# Vivado block design Uart_ETH, xc7z020clg400-1, Vivado 2017.2
# (continued, part 3 of 6)
current_bd_instance /Uart_Blocks/Uart_1
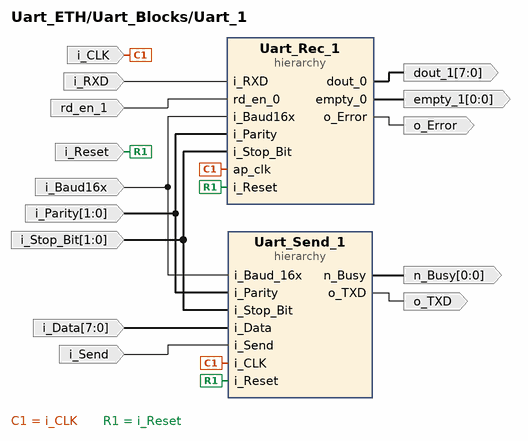
[diagram p48: block diagram inside /Uart_Blocks/Uart_1]
create_bd_pin -dir I -type clk i_CLK
create_bd_pin -dir I i_RXD
create_bd_pin -dir I -type rst i_Reset
create_bd_pin -dir I rd_en_1
create_bd_pin -dir O -from 7 -to 0 dout_1
create_bd_pin -dir O -from 0 -to 0 empty_1
create_bd_pin -dir I -from 7 -to 0 i_Data
create_bd_pin -dir O -from 0 -to 0 n_Busy
create_bd_pin -dir I i_Send
create_bd_pin -dir O o_TXD
create_bd_pin -dir I i_Baud16x
create_bd_pin -dir I -from 1 -to 0 i_Parity
create_bd_pin -dir I -from 1 -to 0 i_Stop_Bit
create_bd_pin -dir O o_Error

create_bd_cell -type hier Uart_Rec_1
create_bd_cell -type hier Uart_Send_1

# ---- hierarchy /Uart_Blocks/Uart_1/Uart_Rec_1 ----
current_bd_instance /Uart_Blocks/Uart_1/Uart_Rec_1
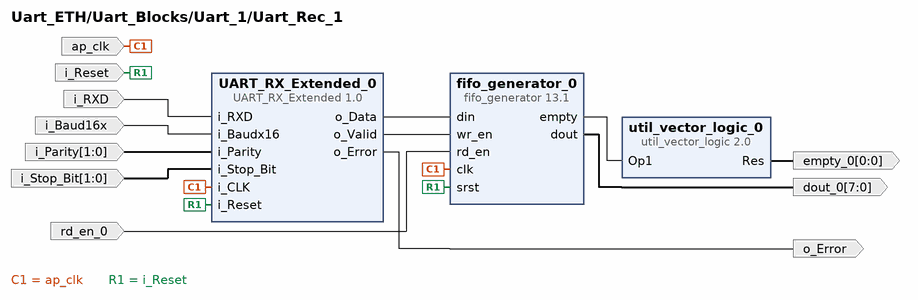
[diagram p49: block diagram inside /Uart_Blocks/Uart_1/Uart_Rec_1]
create_bd_pin -dir I -type clk ap_clk
create_bd_pin -dir I i_RXD
create_bd_pin -dir I -type rst i_Reset
create_bd_pin -dir O -from 7 -to 0 dout_0
create_bd_pin -dir I rd_en_0
create_bd_pin -dir O -from 0 -to 0 empty_0
create_bd_pin -dir I i_Baud16x
create_bd_pin -dir I -from 1 -to 0 i_Parity
create_bd_pin -dir I -from 1 -to 0 i_Stop_Bit
create_bd_pin -dir O o_Error

create_bd_cell -type ip -vlnv xilinx.com:ip:util_vector_logic:2.0 util_vector_logic_0
set_property -dict {CONFIG.C_SIZE 1 CONFIG.C_OPERATION not} [get_bd_cells util_vector_logic_0]
create_bd_cell -type ip -vlnv xilinx.com:ip:fifo_generator:13.1 fifo_generator_0
set_property -dict [list \
  CONFIG.Performance_Options First_Word_Fall_Through \
  CONFIG.Input_Data_Width 8 \
  CONFIG.Input_Depth 256 \
  CONFIG.Output_Data_Width 8 \
  CONFIG.Data_Count true \
  CONFIG.Data_Count_Width 9 \
] [get_bd_cells fifo_generator_0]
create_bd_cell -type ip -vlnv xilinx.com:user:UART_RX_Extended:1.0 UART_RX_Extended_0

# ---- hierarchy /Uart_Blocks/Uart_1/Uart_Send_1 ----
current_bd_instance /Uart_Blocks/Uart_1/Uart_Send_1
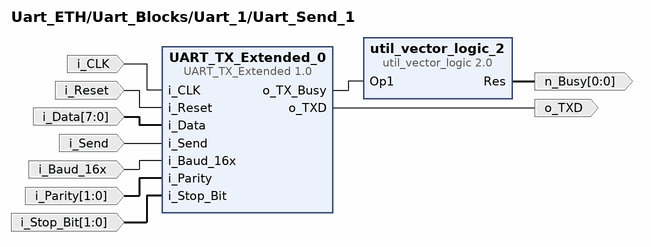
[diagram p50: block diagram inside /Uart_Blocks/Uart_1/Uart_Send_1]
create_bd_pin -dir O -from 0 -to 0 n_Busy
create_bd_pin -dir I -type clk i_CLK
create_bd_pin -dir I -type rst i_Reset
create_bd_pin -dir I -from 7 -to 0 i_Data
create_bd_pin -dir I i_Send
create_bd_pin -dir O o_TXD
create_bd_pin -dir I i_Baud_16x
create_bd_pin -dir I -from 1 -to 0 i_Parity
create_bd_pin -dir I -from 1 -to 0 i_Stop_Bit

create_bd_cell -type ip -vlnv xilinx.com:ip:util_vector_logic:2.0 util_vector_logic_2
set_property -dict {CONFIG.C_SIZE 1 CONFIG.C_OPERATION not} [get_bd_cells util_vector_logic_2]
create_bd_cell -type ip -vlnv xilinx.com:user:UART_TX_Extended:1.0 UART_TX_Extended_0

# ---- hierarchy /Uart_Blocks/Buadrate_Generator ----
current_bd_instance /Uart_Blocks/Buadrate_Generator
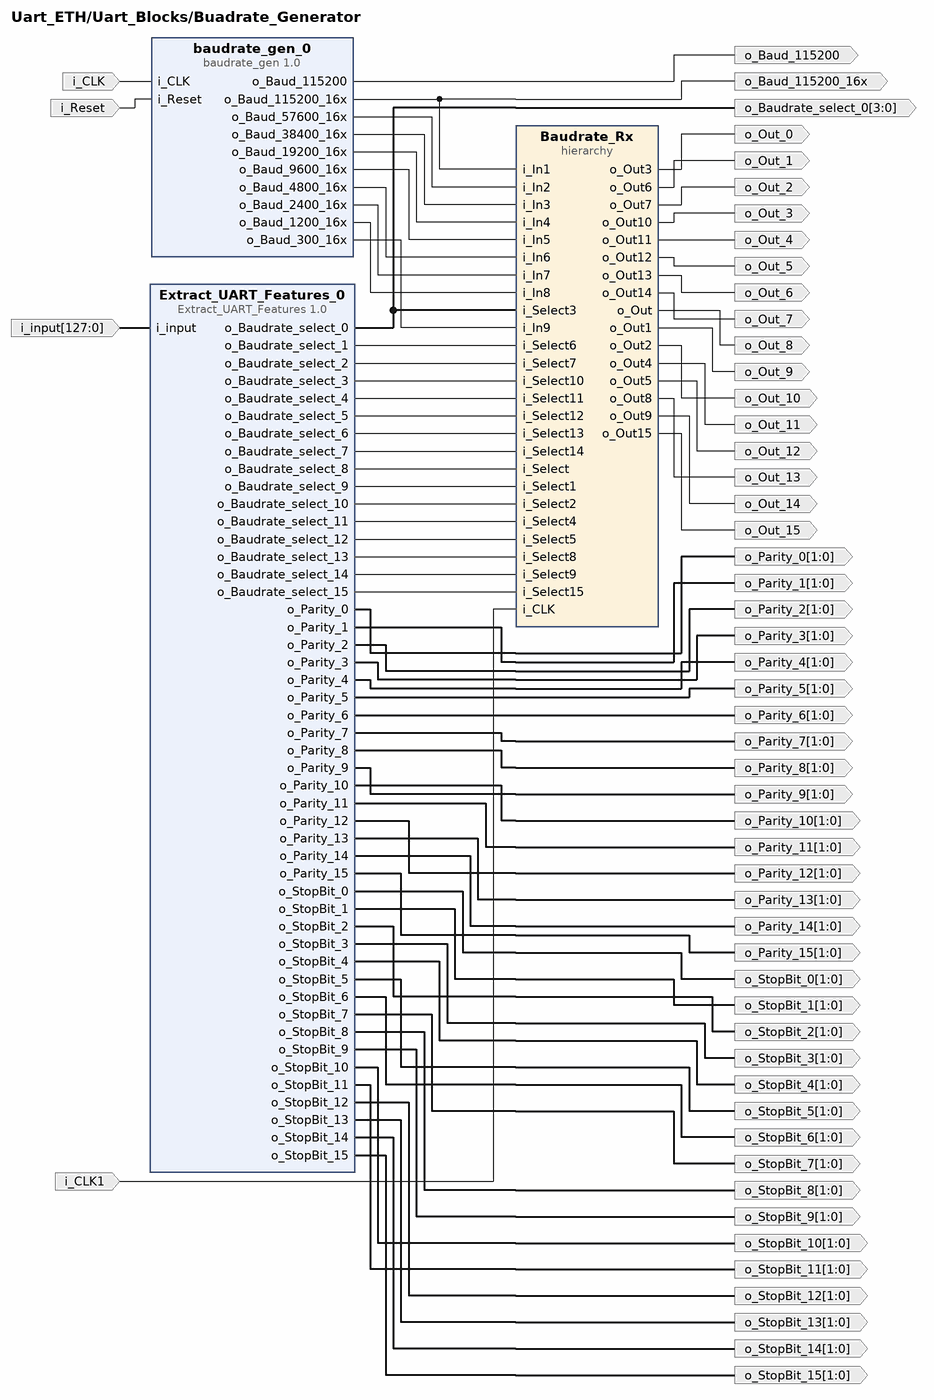
[diagram p51: block diagram inside /Uart_Blocks/Buadrate_Generator]
create_bd_pin -dir I -type clk i_CLK
create_bd_pin -dir I -type rst i_Reset
create_bd_pin -dir I -type clk i_CLK1
create_bd_pin -dir O o_Out_0
create_bd_pin -dir O -from 3 -to 0 o_Baudrate_select_0
create_bd_pin -dir O o_Out_1
create_bd_pin -dir O o_Out_2
create_bd_pin -dir O o_Out_3
create_bd_pin -dir O o_Out_4
create_bd_pin -dir O o_Out_5
create_bd_pin -dir O o_Out_6
create_bd_pin -dir O o_Out_7
create_bd_pin -dir O o_Out_8
create_bd_pin -dir O o_Out_9
create_bd_pin -dir O o_Out_10
create_bd_pin -dir O o_Out_11
create_bd_pin -dir O o_Out_12
create_bd_pin -dir O o_Out_13
create_bd_pin -dir O o_Out_14
create_bd_pin -dir O o_Out_15
create_bd_pin -dir O o_Baud_115200
create_bd_pin -dir O o_Baud_115200_16x
create_bd_pin -dir I -from 127 -to 0 i_input
create_bd_pin -dir O -from 1 -to 0 o_Parity_0
create_bd_pin -dir O -from 1 -to 0 o_Parity_1
create_bd_pin -dir O -from 1 -to 0 o_Parity_2
create_bd_pin -dir O -from 1 -to 0 o_Parity_3
create_bd_pin -dir O -from 1 -to 0 o_Parity_4
create_bd_pin -dir O -from 1 -to 0 o_Parity_5
create_bd_pin -dir O -from 1 -to 0 o_Parity_6
create_bd_pin -dir O -from 1 -to 0 o_Parity_7
create_bd_pin -dir O -from 1 -to 0 o_Parity_8
create_bd_pin -dir O -from 1 -to 0 o_Parity_9
create_bd_pin -dir O -from 1 -to 0 o_Parity_10
create_bd_pin -dir O -from 1 -to 0 o_Parity_11
create_bd_pin -dir O -from 1 -to 0 o_Parity_12
create_bd_pin -dir O -from 1 -to 0 o_Parity_13
create_bd_pin -dir O -from 1 -to 0 o_Parity_14
create_bd_pin -dir O -from 1 -to 0 o_Parity_15
create_bd_pin -dir O -from 1 -to 0 o_StopBit_0
create_bd_pin -dir O -from 1 -to 0 o_StopBit_1
create_bd_pin -dir O -from 1 -to 0 o_StopBit_2
create_bd_pin -dir O -from 1 -to 0 o_StopBit_3
create_bd_pin -dir O -from 1 -to 0 o_StopBit_4
create_bd_pin -dir O -from 1 -to 0 o_StopBit_5
create_bd_pin -dir O -from 1 -to 0 o_StopBit_6
create_bd_pin -dir O -from 1 -to 0 o_StopBit_7
create_bd_pin -dir O -from 1 -to 0 o_StopBit_8
create_bd_pin -dir O -from 1 -to 0 o_StopBit_9
create_bd_pin -dir O -from 1 -to 0 o_StopBit_10
create_bd_pin -dir O -from 1 -to 0 o_StopBit_11
create_bd_pin -dir O -from 1 -to 0 o_StopBit_12
create_bd_pin -dir O -from 1 -to 0 o_StopBit_13
create_bd_pin -dir O -from 1 -to 0 o_StopBit_14
create_bd_pin -dir O -from 1 -to 0 o_StopBit_15

create_bd_cell -type ip -vlnv xilinx.com:user:baudrate_gen:1.0 baudrate_gen_0
create_bd_cell -type hier Baudrate_Rx
create_bd_cell -type ip -vlnv xilinx.com:user:Extract_UART_Features:1.0 Extract_UART_Features_0

# ---- hierarchy /Uart_Blocks/Buadrate_Generator/Baudrate_Rx ----
current_bd_instance /Uart_Blocks/Buadrate_Generator/Baudrate_Rx
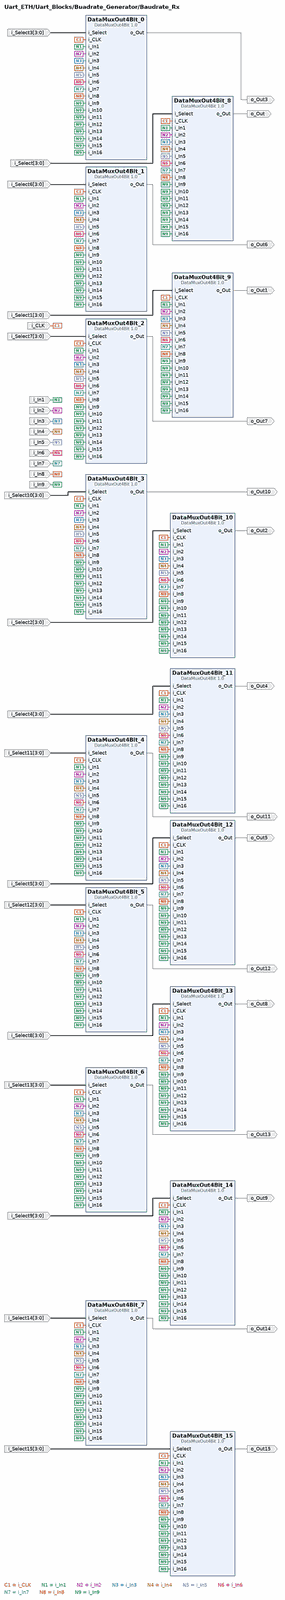
[diagram p52: block diagram inside /Uart_Blocks/Buadrate_Generator/Baudrate_Rx, whole]
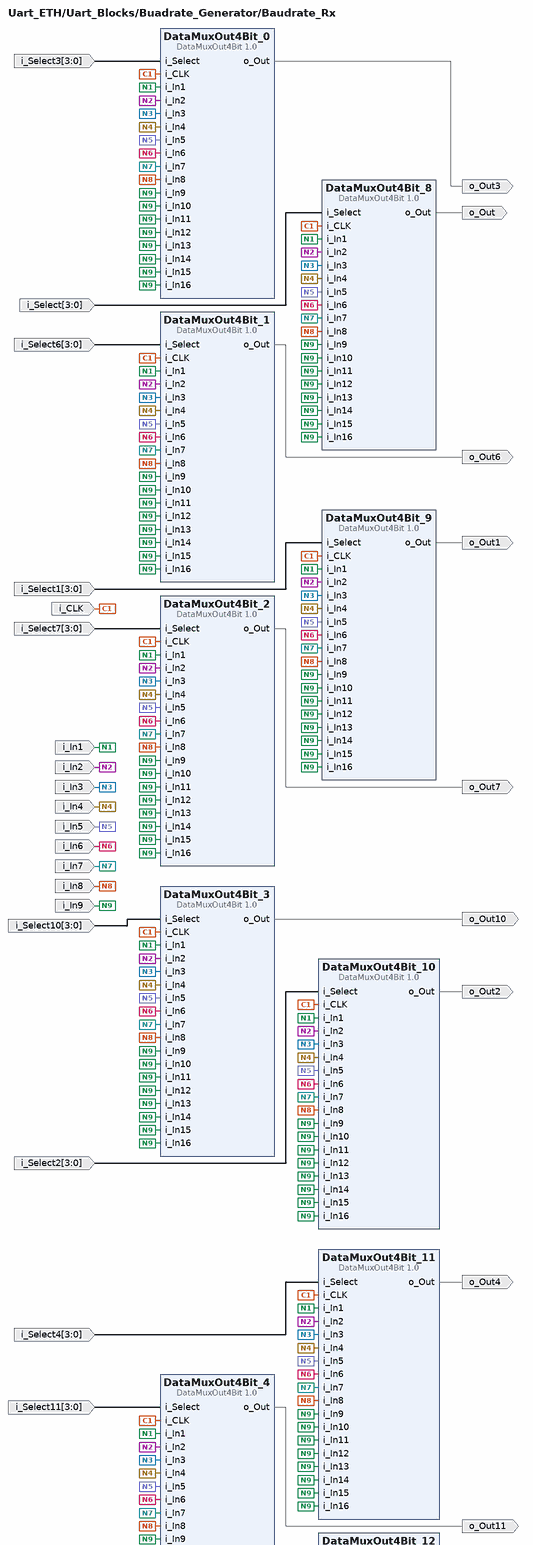
[diagram p53: block diagram inside /Uart_Blocks/Buadrate_Generator/Baudrate_Rx, upper part]
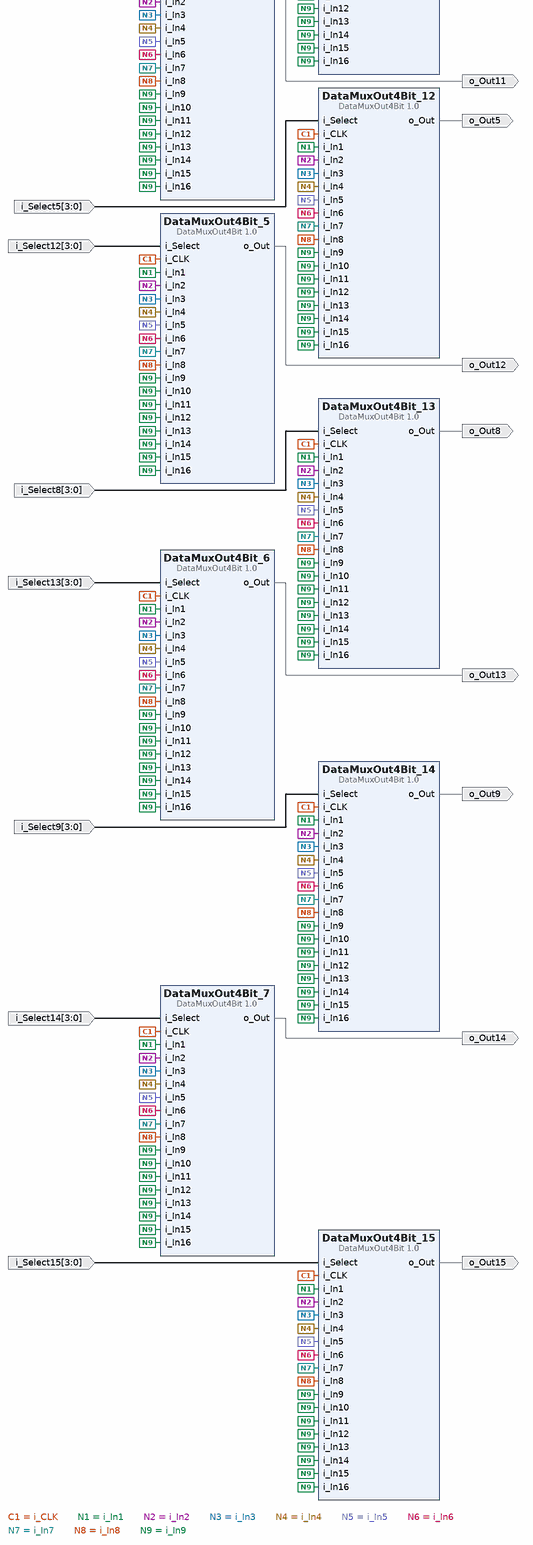
[diagram p54: block diagram inside /Uart_Blocks/Buadrate_Generator/Baudrate_Rx, lower part]
create_bd_pin -dir I -type clk i_CLK
create_bd_pin -dir I i_In1
create_bd_pin -dir I i_In2
create_bd_pin -dir I i_In3
create_bd_pin -dir I i_In4
create_bd_pin -dir I i_In5
create_bd_pin -dir I i_In6
create_bd_pin -dir I i_In7
create_bd_pin -dir I i_In8
create_bd_pin -dir I i_In9
create_bd_pin -dir O o_Out
create_bd_pin -dir I -from 3 -to 0 i_Select
create_bd_pin -dir O o_Out1
create_bd_pin -dir I -from 3 -to 0 i_Select1
create_bd_pin -dir O o_Out2
create_bd_pin -dir I -from 3 -to 0 i_Select2
create_bd_pin -dir O o_Out3
create_bd_pin -dir I -from 3 -to 0 i_Select3
create_bd_pin -dir O o_Out4
create_bd_pin -dir I -from 3 -to 0 i_Select4
create_bd_pin -dir O o_Out5
create_bd_pin -dir I -from 3 -to 0 i_Select5
create_bd_pin -dir O o_Out6
create_bd_pin -dir I -from 3 -to 0 i_Select6
create_bd_pin -dir O o_Out7
create_bd_pin -dir I -from 3 -to 0 i_Select7
create_bd_pin -dir O o_Out8
create_bd_pin -dir I -from 3 -to 0 i_Select8
create_bd_pin -dir O o_Out9
create_bd_pin -dir I -from 3 -to 0 i_Select9
create_bd_pin -dir O o_Out10
create_bd_pin -dir I -from 3 -to 0 i_Select10
create_bd_pin -dir O o_Out11
create_bd_pin -dir I -from 3 -to 0 i_Select11
create_bd_pin -dir O o_Out12
create_bd_pin -dir I -from 3 -to 0 i_Select12
create_bd_pin -dir O o_Out13
create_bd_pin -dir I -from 3 -to 0 i_Select13
create_bd_pin -dir O o_Out14
create_bd_pin -dir I -from 3 -to 0 i_Select14
create_bd_pin -dir O o_Out15
create_bd_pin -dir I -from 3 -to 0 i_Select15

create_bd_cell -type ip -vlnv xilinx.com:user:DataMuxOut4Bit:1.0 DataMuxOut4Bit_8
create_bd_cell -type ip -vlnv xilinx.com:user:DataMuxOut4Bit:1.0 DataMuxOut4Bit_9
create_bd_cell -type ip -vlnv xilinx.com:user:DataMuxOut4Bit:1.0 DataMuxOut4Bit_10
create_bd_cell -type ip -vlnv xilinx.com:user:DataMuxOut4Bit:1.0 DataMuxOut4Bit_0
create_bd_cell -type ip -vlnv xilinx.com:user:DataMuxOut4Bit:1.0 DataMuxOut4Bit_11
create_bd_cell -type ip -vlnv xilinx.com:user:DataMuxOut4Bit:1.0 DataMuxOut4Bit_12
create_bd_cell -type ip -vlnv xilinx.com:user:DataMuxOut4Bit:1.0 DataMuxOut4Bit_1
create_bd_cell -type ip -vlnv xilinx.com:user:DataMuxOut4Bit:1.0 DataMuxOut4Bit_2
create_bd_cell -type ip -vlnv xilinx.com:user:DataMuxOut4Bit:1.0 DataMuxOut4Bit_13
create_bd_cell -type ip -vlnv xilinx.com:user:DataMuxOut4Bit:1.0 DataMuxOut4Bit_14
create_bd_cell -type ip -vlnv xilinx.com:user:DataMuxOut4Bit:1.0 DataMuxOut4Bit_3
create_bd_cell -type ip -vlnv xilinx.com:user:DataMuxOut4Bit:1.0 DataMuxOut4Bit_4
create_bd_cell -type ip -vlnv xilinx.com:user:DataMuxOut4Bit:1.0 DataMuxOut4Bit_5
create_bd_cell -type ip -vlnv xilinx.com:user:DataMuxOut4Bit:1.0 DataMuxOut4Bit_6
create_bd_cell -type ip -vlnv xilinx.com:user:DataMuxOut4Bit:1.0 DataMuxOut4Bit_7
create_bd_cell -type ip -vlnv xilinx.com:user:DataMuxOut4Bit:1.0 DataMuxOut4Bit_15

# ---- hierarchy /Uart_Blocks/Uart_config ----
current_bd_instance /Uart_Blocks/Uart_config
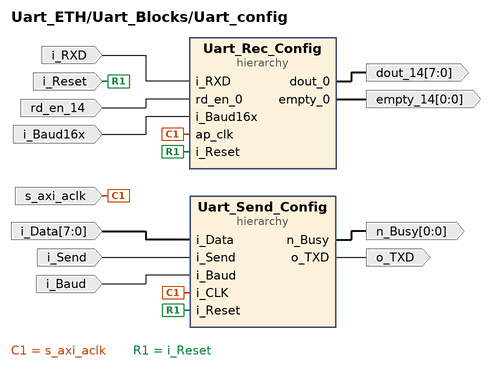
[diagram p55: block diagram inside /Uart_Blocks/Uart_config]
create_bd_pin -dir I -type clk s_axi_aclk
create_bd_pin -dir I i_RXD
create_bd_pin -dir I -type rst i_Reset
create_bd_pin -dir O -from 7 -to 0 dout_14
create_bd_pin -dir O -from 0 -to 0 empty_14
create_bd_pin -dir I rd_en_14
create_bd_pin -dir I -from 7 -to 0 i_Data
create_bd_pin -dir I i_Send
create_bd_pin -dir O -from 0 -to 0 n_Busy
create_bd_pin -dir O o_TXD
create_bd_pin -dir I i_Baud
create_bd_pin -dir I i_Baud16x

create_bd_cell -type hier Uart_Send_Config
create_bd_cell -type hier Uart_Rec_Config

# ---- hierarchy /Uart_Blocks/Uart_config/Uart_Send_Config ----
current_bd_instance /Uart_Blocks/Uart_config/Uart_Send_Config
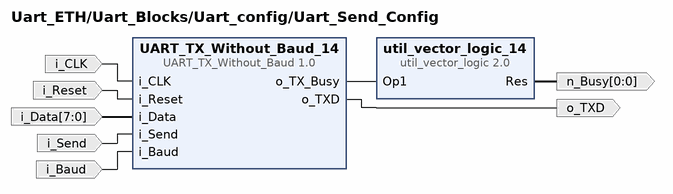
[diagram p56: block diagram inside /Uart_Blocks/Uart_config/Uart_Send_Config]
create_bd_pin -dir O -from 0 -to 0 n_Busy
create_bd_pin -dir I -type clk i_CLK
create_bd_pin -dir I -type rst i_Reset
create_bd_pin -dir I -from 7 -to 0 i_Data
create_bd_pin -dir I i_Send
create_bd_pin -dir O o_TXD
create_bd_pin -dir I i_Baud

create_bd_cell -type ip -vlnv xilinx.com:ip:util_vector_logic:2.0 util_vector_logic_14
set_property -dict {CONFIG.C_SIZE 1 CONFIG.C_OPERATION not} [get_bd_cells util_vector_logic_14]
create_bd_cell -type ip -vlnv xilinx.com:user:UART_TX_Without_Baud:1.0 UART_TX_Without_Baud_14

# ---- hierarchy /Uart_Blocks/Uart_config/Uart_Rec_Config ----
current_bd_instance /Uart_Blocks/Uart_config/Uart_Rec_Config
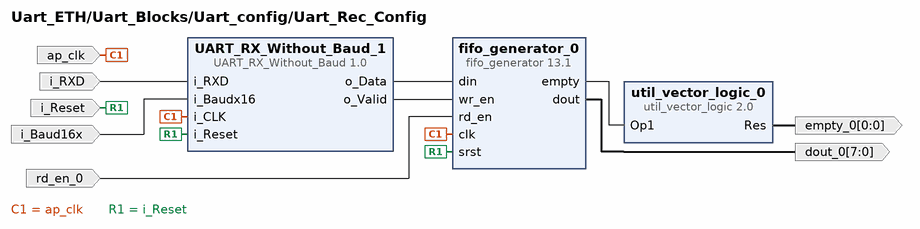
[diagram p57: block diagram inside /Uart_Blocks/Uart_config/Uart_Rec_Config]
create_bd_pin -dir I -type clk ap_clk
create_bd_pin -dir I i_RXD
create_bd_pin -dir I -type rst i_Reset
create_bd_pin -dir O -from 7 -to 0 dout_0
create_bd_pin -dir I rd_en_0
create_bd_pin -dir O -from 0 -to 0 empty_0
create_bd_pin -dir I i_Baud16x

create_bd_cell -type ip -vlnv xilinx.com:ip:util_vector_logic:2.0 util_vector_logic_0
set_property -dict {CONFIG.C_SIZE 1 CONFIG.C_OPERATION not} [get_bd_cells util_vector_logic_0]
create_bd_cell -type ip -vlnv xilinx.com:ip:fifo_generator:13.1 fifo_generator_0
set_property -dict [list \
  CONFIG.Performance_Options First_Word_Fall_Through \
  CONFIG.Input_Data_Width 8 \
  CONFIG.Input_Depth 256 \
  CONFIG.Output_Data_Width 8 \
  CONFIG.Data_Count true \
  CONFIG.Data_Count_Width 9 \
] [get_bd_cells fifo_generator_0]
create_bd_cell -type ip -vlnv xilinx.com:user:UART_RX_Without_Baud:1.0 UART_RX_Without_Baud_1

# ---- hierarchy /Uart_Blocks/Uart_Master_Slave ----
current_bd_instance /Uart_Blocks/Uart_Master_Slave
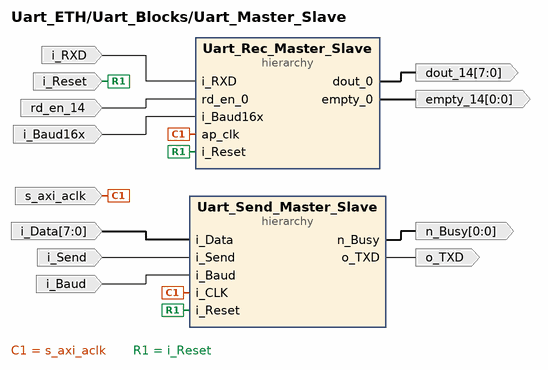
[diagram p58: block diagram inside /Uart_Blocks/Uart_Master_Slave]
create_bd_pin -dir I -type clk s_axi_aclk
create_bd_pin -dir I i_RXD
create_bd_pin -dir I -type rst i_Reset
create_bd_pin -dir O -from 7 -to 0 dout_14
create_bd_pin -dir O -from 0 -to 0 empty_14
create_bd_pin -dir I rd_en_14
create_bd_pin -dir I -from 7 -to 0 i_Data
create_bd_pin -dir I i_Send
create_bd_pin -dir O -from 0 -to 0 n_Busy
create_bd_pin -dir O o_TXD
create_bd_pin -dir I i_Baud
create_bd_pin -dir I i_Baud16x

create_bd_cell -type hier Uart_Send_Master_Slave
create_bd_cell -type hier Uart_Rec_Master_Slave

# ---- hierarchy /Uart_Blocks/Uart_Master_Slave/Uart_Send_Master_Slave ----
current_bd_instance /Uart_Blocks/Uart_Master_Slave/Uart_Send_Master_Slave
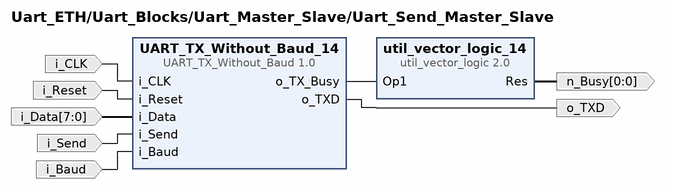
[diagram p59: block diagram inside /Uart_Blocks/Uart_Master_Slave/Uart_Send_Master_Slave]
create_bd_pin -dir O -from 0 -to 0 n_Busy
create_bd_pin -dir I -type clk i_CLK
create_bd_pin -dir I -type rst i_Reset
create_bd_pin -dir I -from 7 -to 0 i_Data
create_bd_pin -dir I i_Send
create_bd_pin -dir O o_TXD
create_bd_pin -dir I i_Baud

create_bd_cell -type ip -vlnv xilinx.com:ip:util_vector_logic:2.0 util_vector_logic_14
set_property -dict {CONFIG.C_SIZE 1 CONFIG.C_OPERATION not} [get_bd_cells util_vector_logic_14]
create_bd_cell -type ip -vlnv xilinx.com:user:UART_TX_Without_Baud:1.0 UART_TX_Without_Baud_14

# ---- hierarchy /Uart_Blocks/Uart_Master_Slave/Uart_Rec_Master_Slave ----
current_bd_instance /Uart_Blocks/Uart_Master_Slave/Uart_Rec_Master_Slave
create_bd_pin -dir I -type clk ap_clk
create_bd_pin -dir I i_RXD
create_bd_pin -dir I -type rst i_Reset
create_bd_pin -dir O -from 7 -to 0 dout_0
create_bd_pin -dir I rd_en_0
create_bd_pin -dir O -from 0 -to 0 empty_0
create_bd_pin -dir I i_Baud16x

create_bd_cell -type ip -vlnv xilinx.com:ip:util_vector_logic:2.0 util_vector_logic_0
set_property -dict {CONFIG.C_SIZE 1 CONFIG.C_OPERATION not} [get_bd_cells util_vector_logic_0]
create_bd_cell -type ip -vlnv xilinx.com:ip:fifo_generator:13.1 fifo_generator_0
set_property -dict [list \
  CONFIG.Performance_Options First_Word_Fall_Through \
  CONFIG.Input_Data_Width 8 \
  CONFIG.Input_Depth 256 \
  CONFIG.Output_Data_Width 8 \
  CONFIG.Data_Count true \
  CONFIG.Data_Count_Width 9 \
] [get_bd_cells fifo_generator_0]
create_bd_cell -type ip -vlnv xilinx.com:user:UART_RX_Without_Baud:1.0 UART_RX_Without_Baud_1

# ---- hierarchy /Clock_Managment ----
current_bd_instance /Clock_Managment
create_bd_pin -dir I -type clk clk_in1
create_bd_pin -dir O -type clk clk_92M
create_bd_pin -dir I -type rst ext_reset_in
create_bd_pin -dir O -from 0 -to 0 -type rst peripheral_reset
create_bd_pin -dir O -from 0 -to 0 -type rst interconnect_aresetn
create_bd_pin -dir O -from 0 -to 0 -type rst peripheral_aresetn
create_bd_pin -dir O -type clk clk_18M
create_bd_pin -dir O -from 0 -to 0 -type rst peripheral_reset1

create_bd_cell -type ip -vlnv xilinx.com:ip:clk_wiz:5.4 clk_wiz_1
set_property -dict [list \
  CONFIG.CLKOUT1_REQUESTED_OUT_FREQ 18.432 \
  CONFIG.MMCM_DIVCLK_DIVIDE 7 \
  CONFIG.MMCM_CLKFBOUT_MULT_F 61.125 \
  CONFIG.MMCM_CLKOUT0_DIVIDE_F 47.375 \
  CONFIG.CLKOUT1_JITTER 437.060 \
  CONFIG.CLKOUT1_PHASE_ERROR 514.970 \
] [get_bd_cells clk_wiz_1]
create_bd_cell -type ip -vlnv xilinx.com:ip:proc_sys_reset:5.0 rst_ps7_0_92M
create_bd_cell -type ip -vlnv xilinx.com:ip:util_vector_logic:2.0 util_vector_logic_0
set_property -dict {CONFIG.C_SIZE 1 CONFIG.C_OPERATION not} [get_bd_cells util_vector_logic_0]
create_bd_cell -type ip -vlnv xilinx.com:ip:proc_sys_reset:5.0 rst_ps7_0_18M
create_bd_cell -type ip -vlnv xilinx.com:ip:clk_wiz:5.4 clk_wiz_0
set_property -dict [list \
  CONFIG.PRIM_IN_FREQ 18.431963 \
  CONFIG.CLKIN1_JITTER_PS 542.5300000000001 \
  CONFIG.CLKOUT2_USED true \
  CONFIG.NUM_OUT_CLKS 2 \
  CONFIG.CLK_OUT1_PORT clk_18M \
  CONFIG.CLK_OUT2_PORT clk_92M \
  CONFIG.CLKOUT1_REQUESTED_OUT_FREQ 18.431963 \
  CONFIG.CLKOUT2_REQUESTED_OUT_FREQ 92.159815 \
  CONFIG.PRIM_SOURCE No_buffer \
  CONFIG.MMCM_DIVCLK_DIVIDE 1 \
  CONFIG.MMCM_CLKFBOUT_MULT_F 55.000 \
  CONFIG.MMCM_CLKIN1_PERIOD 54.254 \
  CONFIG.MMCM_CLKIN2_PERIOD 10.0 \
  CONFIG.MMCM_CLKOUT0_DIVIDE_F 55.000 \
  CONFIG.MMCM_CLKOUT1_DIVIDE 11 \
  CONFIG.CLKOUT1_JITTER 386.146 \
  CONFIG.CLKOUT1_PHASE_ERROR 339.355 \
  CONFIG.CLKOUT2_JITTER 270.877 \
  CONFIG.CLKOUT2_PHASE_ERROR 339.355 \
] [get_bd_cells clk_wiz_0]
create_bd_cell -type ip -vlnv xilinx.com:ip:util_vector_logic:2.0 util_vector_logic_1
set_property -dict {CONFIG.C_SIZE 1 CONFIG.C_OPERATION not} [get_bd_cells util_vector_logic_1]

# ---- hierarchy /LCD_Pins ----
current_bd_instance /LCD_Pins
create_bd_pin -dir O -from 7 -to 0 Data
create_bd_pin -dir O -from 0 -to 0 RS
create_bd_pin -dir O -from 0 -to 0 RST
create_bd_pin -dir O -from 0 -to 0 CS1
create_bd_pin -dir O -from 0 -to 0 RW
create_bd_pin -dir O -from 0 -to 0 EN
create_bd_pin -dir O -from 0 -to 0 CS2
create_bd_pin -dir O -from 0 -to 0 backlight
create_bd_pin -dir I -from 43 -to 0 Din

create_bd_cell -type ip -vlnv xilinx.com:ip:xlslice:1.0 xlslice_LCD_DATA
set_property -dict {CONFIG.DIN_TO 0 CONFIG.DIN_FROM 7 CONFIG.DIN_WIDTH 15 CONFIG.DOUT_WIDTH 8} [get_bd_cells xlslice_LCD_DATA]
create_bd_cell -type ip -vlnv xilinx.com:ip:xlslice:1.0 xlslice_LCD
set_property -dict {CONFIG.DIN_TO 23 CONFIG.DIN_FROM 37 CONFIG.DIN_WIDTH 44 CONFIG.DOUT_WIDTH 15} [get_bd_cells xlslice_LCD]
create_bd_cell -type ip -vlnv xilinx.com:ip:xlslice:1.0 xlslice_LCD_RS
set_property -dict {CONFIG.DIN_TO 10 CONFIG.DIN_FROM 10 CONFIG.DIN_WIDTH 15 CONFIG.DOUT_WIDTH 1} [get_bd_cells xlslice_LCD_RS]
create_bd_cell -type ip -vlnv xilinx.com:ip:xlslice:1.0 xlslice_LCD_RST
set_property -dict {CONFIG.DIN_TO 12 CONFIG.DIN_FROM 12 CONFIG.DIN_WIDTH 15 CONFIG.DOUT_WIDTH 1} [get_bd_cells xlslice_LCD_RST]
create_bd_cell -type ip -vlnv xilinx.com:ip:xlslice:1.0 xlslice_LCD_CS1
set_property -dict {CONFIG.DIN_TO 8 CONFIG.DIN_FROM 8 CONFIG.DIN_WIDTH 15 CONFIG.DOUT_WIDTH 1} [get_bd_cells xlslice_LCD_CS1]
create_bd_cell -type ip -vlnv xilinx.com:ip:xlslice:1.0 xlslice_LCD_RW
set_property -dict {CONFIG.DIN_TO 13 CONFIG.DIN_FROM 13 CONFIG.DIN_WIDTH 15 CONFIG.DOUT_WIDTH 1} [get_bd_cells xlslice_LCD_RW]
create_bd_cell -type ip -vlnv xilinx.com:ip:xlslice:1.0 xlslice_LCD_EN
set_property -dict {CONFIG.DIN_TO 11 CONFIG.DIN_FROM 11 CONFIG.DIN_WIDTH 15 CONFIG.DOUT_WIDTH 1} [get_bd_cells xlslice_LCD_EN]
create_bd_cell -type ip -vlnv xilinx.com:ip:xlslice:1.0 xlslice_LCDCS2
set_property -dict {CONFIG.DIN_TO 9 CONFIG.DIN_FROM 9 CONFIG.DIN_WIDTH 15 CONFIG.DOUT_WIDTH 1} [get_bd_cells xlslice_LCDCS2]
create_bd_cell -type ip -vlnv xilinx.com:ip:xlslice:1.0 xlslice_LCD_Backlight
set_property -dict [list \
  CONFIG.DIN_TO 14 \
  CONFIG.DIN_FROM 14 \
  CONFIG.DIN_WIDTH 15 \
  CONFIG.DOUT_WIDTH 1 \
] [get_bd_cells xlslice_LCD_Backlight]

# ---- hierarchy /Timer_Interrupt ----
current_bd_instance /Timer_Interrupt
create_bd_pin -dir I -type clk i_CLK
create_bd_pin -dir I -type rst i_Reset
create_bd_pin -dir O o_Valid
create_bd_pin -dir O -from 7 -to 0 o_Count
create_bd_pin -dir O o_Tic_1ms
create_bd_pin -dir O -from 0 -to 0 dout

create_bd_cell -type ip -vlnv xilinx.com:user:Tick_Timer_General:1.0 Tick_Timer_General_KeyPad
set_property -dict {CONFIG.Frequency 92160000} [get_bd_cells Tick_Timer_General_KeyPad]
create_bd_cell -type ip -vlnv xilinx.com:user:Counter:1.0 Counter_0
set_property -dict {CONFIG.Count_Tick 0x000A} [get_bd_cells Counter_0]
create_bd_cell -type ip -vlnv xilinx.com:ip:xlconstant:1.1 xlconstant_0
create_bd_cell -type ip -vlnv xilinx.com:ip:util_vector_logic:2.0 util_vector_logic_0
set_property -dict {CONFIG.C_SIZE 1 CONFIG.C_OPERATION not} [get_bd_cells util_vector_logic_0]

# ---- hierarchy /LED_Panel_diagram ----
current_bd_instance /LED_Panel_diagram
create_bd_pin -dir I -type clk i_CLK
create_bd_pin -dir I -type rst i_Reset
create_bd_pin -dir O -type clk o_CLK
create_bd_pin -dir O o_Data
create_bd_pin -dir O o_Latch
create_bd_pin -dir I -from 0 -to 0 Op1
create_bd_pin -dir I -from 0 -to 0 Op2
create_bd_pin -dir I -from 0 -to 0 Op3
create_bd_pin -dir I -from 0 -to 0 Op4
create_bd_pin -dir I -from 0 -to 0 Op5
create_bd_pin -dir I -from 0 -to 0 Op6
create_bd_pin -dir I -from 0 -to 0 Op7
create_bd_pin -dir I -from 0 -to 0 Op8
create_bd_pin -dir I -from 0 -to 0 Op9
create_bd_pin -dir I -from 0 -to 0 Op10
create_bd_pin -dir I -from 0 -to 0 Op11
create_bd_pin -dir I -from 0 -to 0 Op12
create_bd_pin -dir I -from 0 -to 0 Op13
create_bd_pin -dir I -from 0 -to 0 Op14
create_bd_pin -dir I -from 0 -to 0 Op15
create_bd_pin -dir I -from 0 -to 0 Op16
create_bd_pin -dir I -from 0 -to 0 Op17
create_bd_pin -dir I -from 0 -to 0 Op18
create_bd_pin -dir I -from 0 -to 0 Op19
create_bd_pin -dir I -from 0 -to 0 Op20
create_bd_pin -dir I -from 0 -to 0 Op21
create_bd_pin -dir I -from 0 -to 0 Op22
create_bd_pin -dir I -from 0 -to 0 Op23
create_bd_pin -dir I -from 0 -to 0 Op24
create_bd_pin -dir I -from 0 -to 0 Op25
create_bd_pin -dir I -from 0 -to 0 Op26
create_bd_pin -dir I -from 0 -to 0 Op27
create_bd_pin -dir I -from 0 -to 0 Op28
create_bd_pin -dir I -from 0 -to 0 Op29
create_bd_pin -dir I -from 0 -to 0 Op30
create_bd_pin -dir I -from 0 -to 0 Op31
create_bd_pin -dir I -from 0 -to 0 Op32

create_bd_cell -type hier LED_Panel
create_bd_cell -type hier Not_Block

# ---- hierarchy /LED_Panel_diagram/LED_Panel ----
current_bd_instance /LED_Panel_diagram/LED_Panel
create_bd_pin -dir I -type clk i_CLK
create_bd_pin -dir I -type rst i_Reset
create_bd_pin -dir I i_in1
create_bd_pin -dir I i_in2
create_bd_pin -dir I i_in3
create_bd_pin -dir I i_in4
create_bd_pin -dir I i_in5
create_bd_pin -dir I i_in6
create_bd_pin -dir I i_in7
create_bd_pin -dir I i_in8
create_bd_pin -dir I i_in9
create_bd_pin -dir I i_in10
create_bd_pin -dir I i_in11
create_bd_pin -dir I i_in12
create_bd_pin -dir I i_in13
create_bd_pin -dir I i_in14
create_bd_pin -dir I i_in15
create_bd_pin -dir I i_in16
create_bd_pin -dir I i_in17
create_bd_pin -dir I i_in18
create_bd_pin -dir I i_in19
create_bd_pin -dir I i_in20
create_bd_pin -dir I i_in21
create_bd_pin -dir I i_in22
create_bd_pin -dir I i_in23
create_bd_pin -dir I i_in24
create_bd_pin -dir O -type clk o_CLK
create_bd_pin -dir O o_Data
create_bd_pin -dir O o_Latch
create_bd_pin -dir I i_in25
create_bd_pin -dir I i_in26
create_bd_pin -dir I i_in27
create_bd_pin -dir I i_in28
create_bd_pin -dir I i_in29
create_bd_pin -dir I i_in30
create_bd_pin -dir I i_in31
create_bd_pin -dir I i_in32

create_bd_cell -type ip -vlnv xilinx.com:user:LED_Sample:1.0 LED_Sample_1
set_property -dict {CONFIG.Count_Tick 0x020} [get_bd_cells LED_Sample_1]
create_bd_cell -type ip -vlnv xilinx.com:user:LED_Sample:1.0 LED_Sample_2
set_property -dict {CONFIG.Count_Tick 0x020} [get_bd_cells LED_Sample_2]
create_bd_cell -type ip -vlnv xilinx.com:user:LED_Sample:1.0 LED_Sample_3
set_property -dict {CONFIG.Count_Tick 0x020} [get_bd_cells LED_Sample_3]
create_bd_cell -type ip -vlnv xilinx.com:ip:xlconcat:2.1 xlconcat_0
set_property -dict {CONFIG.NUM_PORTS 32} [get_bd_cells xlconcat_0]
create_bd_cell -type ip -vlnv xilinx.com:user:Register_8_Input:1.0 Register_8_Input_Tx1
create_bd_cell -type ip -vlnv xilinx.com:user:Register_8_Input:1.0 Register_8_Input_Tx2
create_bd_cell -type ip -vlnv xilinx.com:user:Register_8_Input:1.0 Register_8_Input_Rx1
create_bd_cell -type ip -vlnv xilinx.com:user:LED_Sample:1.0 LED_Sample_0
set_property -dict {CONFIG.Count_Tick 0x020} [get_bd_cells LED_Sample_0]
create_bd_cell -type ip -vlnv xilinx.com:user:Register_8_Input:1.0 Register_8_Input_Rx2
create_bd_cell -type ip -vlnv xilinx.com:user:LED_Tester:1.0 LED_Tester_0
create_bd_cell -type ip -vlnv xilinx.com:ip:util_vector_logic:2.0 util_vector_logic_0
set_property -dict {CONFIG.C_SIZE 1 CONFIG.C_OPERATION not} [get_bd_cells util_vector_logic_0]
create_bd_cell -type ip -vlnv xilinx.com:user:Tick_Timer_General:1.0 Tick_Timer_General_0
set_property -dict {CONFIG.Frequency 92160000} [get_bd_cells Tick_Timer_General_0]
create_bd_cell -type ip -vlnv xilinx.com:user:PISO:1.0 PISO_0
set_property -dict {CONFIG.g_DataWidth 32} [get_bd_cells PISO_0]

# ---- hierarchy /LED_Panel_diagram/Not_Block ----
current_bd_instance /LED_Panel_diagram/Not_Block
create_bd_pin -dir I -from 0 -to 0 Op1
create_bd_pin -dir O -from 0 -to 0 Res
create_bd_pin -dir I -from 0 -to 0 Op2
create_bd_pin -dir O -from 0 -to 0 Res1
create_bd_pin -dir I -from 0 -to 0 Op3
create_bd_pin -dir O -from 0 -to 0 Res2
create_bd_pin -dir I -from 0 -to 0 Op4
create_bd_pin -dir O -from 0 -to 0 Res3
create_bd_pin -dir I -from 0 -to 0 Op5
create_bd_pin -dir O -from 0 -to 0 Res4
create_bd_pin -dir I -from 0 -to 0 Op6
create_bd_pin -dir O -from 0 -to 0 Res5
create_bd_pin -dir I -from 0 -to 0 Op7
create_bd_pin -dir O -from 0 -to 0 Res6
create_bd_pin -dir I -from 0 -to 0 Op8
create_bd_pin -dir O -from 0 -to 0 Res7
create_bd_pin -dir I -from 0 -to 0 Op9
create_bd_pin -dir O -from 0 -to 0 Res8
create_bd_pin -dir I -from 0 -to 0 Op10
create_bd_pin -dir O -from 0 -to 0 Res9
create_bd_pin -dir I -from 0 -to 0 Op11
create_bd_pin -dir O -from 0 -to 0 Res10
create_bd_pin -dir I -from 0 -to 0 Op12
create_bd_pin -dir O -from 0 -to 0 Res11
create_bd_pin -dir I -from 0 -to 0 Op13
create_bd_pin -dir O -from 0 -to 0 Res12
create_bd_pin -dir O -from 0 -to 0 Res13
create_bd_pin -dir I -from 0 -to 0 Op14
create_bd_pin -dir I -from 0 -to 0 Op15
create_bd_pin -dir O -from 0 -to 0 Res14
create_bd_pin -dir I -from 0 -to 0 Op16
create_bd_pin -dir O -from 0 -to 0 Res15
create_bd_pin -dir I -from 0 -to 0 Op17
create_bd_pin -dir O -from 0 -to 0 Res16
create_bd_pin -dir I -from 0 -to 0 Op18
create_bd_pin -dir O -from 0 -to 0 Res17
create_bd_pin -dir I -from 0 -to 0 Op19
create_bd_pin -dir O -from 0 -to 0 Res18
create_bd_pin -dir I -from 0 -to 0 Op20
create_bd_pin -dir O -from 0 -to 0 Res19
create_bd_pin -dir I -from 0 -to 0 Op21
create_bd_pin -dir O -from 0 -to 0 Res20
create_bd_pin -dir I -from 0 -to 0 Op22
create_bd_pin -dir O -from 0 -to 0 Res21
create_bd_pin -dir I -from 0 -to 0 Op23
create_bd_pin -dir O -from 0 -to 0 Res22
create_bd_pin -dir I -from 0 -to 0 Op24
create_bd_pin -dir O -from 0 -to 0 Res23
create_bd_pin -dir I -from 0 -to 0 Op25
create_bd_pin -dir O -from 0 -to 0 Res24
create_bd_pin -dir I -from 0 -to 0 Op26
create_bd_pin -dir O -from 0 -to 0 Res25
create_bd_pin -dir I -from 0 -to 0 Op27
create_bd_pin -dir O -from 0 -to 0 Res26
create_bd_pin -dir I -from 0 -to 0 Op28
create_bd_pin -dir O -from 0 -to 0 Res27
create_bd_pin -dir I -from 0 -to 0 Op29
create_bd_pin -dir O -from 0 -to 0 Res28
create_bd_pin -dir I -from 0 -to 0 Op30
create_bd_pin -dir O -from 0 -to 0 Res29
create_bd_pin -dir I -from 0 -to 0 Op31
create_bd_pin -dir O -from 0 -to 0 Res30
create_bd_pin -dir I -from 0 -to 0 Op32
create_bd_pin -dir O -from 0 -to 0 Res31

create_bd_cell -type ip -vlnv xilinx.com:ip:util_vector_logic:2.0 util_vector_logic_10
set_property -dict {CONFIG.C_SIZE 1 CONFIG.C_OPERATION not} [get_bd_cells util_vector_logic_10]
create_bd_cell -type ip -vlnv xilinx.com:ip:util_vector_logic:2.0 util_vector_logic_0
set_property -dict {CONFIG.C_SIZE 1 CONFIG.C_OPERATION not} [get_bd_cells util_vector_logic_0]
create_bd_cell -type ip -vlnv xilinx.com:ip:util_vector_logic:2.0 util_vector_logic_1
set_property -dict {CONFIG.C_SIZE 1 CONFIG.C_OPERATION not} [get_bd_cells util_vector_logic_1]
create_bd_cell -type ip -vlnv xilinx.com:ip:util_vector_logic:2.0 util_vector_logic_2
set_property -dict {CONFIG.C_SIZE 1 CONFIG.C_OPERATION not} [get_bd_cells util_vector_logic_2]
create_bd_cell -type ip -vlnv xilinx.com:ip:util_vector_logic:2.0 util_vector_logic_3
set_property -dict {CONFIG.C_SIZE 1 CONFIG.C_OPERATION not} [get_bd_cells util_vector_logic_3]
create_bd_cell -type ip -vlnv xilinx.com:ip:util_vector_logic:2.0 util_vector_logic_4
set_property -dict {CONFIG.C_SIZE 1 CONFIG.C_OPERATION not} [get_bd_cells util_vector_logic_4]
create_bd_cell -type ip -vlnv xilinx.com:ip:util_vector_logic:2.0 util_vector_logic_5
set_property -dict {CONFIG.C_SIZE 1 CONFIG.C_OPERATION not} [get_bd_cells util_vector_logic_5]
create_bd_cell -type ip -vlnv xilinx.com:ip:util_vector_logic:2.0 util_vector_logic_6
set_property -dict {CONFIG.C_SIZE 1 CONFIG.C_OPERATION not} [get_bd_cells util_vector_logic_6]
create_bd_cell -type ip -vlnv xilinx.com:ip:util_vector_logic:2.0 util_vector_logic_7
set_property -dict {CONFIG.C_SIZE 1 CONFIG.C_OPERATION not} [get_bd_cells util_vector_logic_7]
create_bd_cell -type ip -vlnv xilinx.com:ip:util_vector_logic:2.0 util_vector_logic_8
set_property -dict {CONFIG.C_SIZE 1 CONFIG.C_OPERATION not} [get_bd_cells util_vector_logic_8]
create_bd_cell -type ip -vlnv xilinx.com:ip:util_vector_logic:2.0 util_vector_logic_9
set_property -dict {CONFIG.C_SIZE 1 CONFIG.C_OPERATION not} [get_bd_cells util_vector_logic_9]
create_bd_cell -type ip -vlnv xilinx.com:ip:util_vector_logic:2.0 util_vector_logic_11
set_property -dict {CONFIG.C_SIZE 1 CONFIG.C_OPERATION not} [get_bd_cells util_vector_logic_11]
create_bd_cell -type ip -vlnv xilinx.com:ip:util_vector_logic:2.0 util_vector_logic_12
set_property -dict {CONFIG.C_SIZE 1 CONFIG.C_OPERATION not} [get_bd_cells util_vector_logic_12]
create_bd_cell -type ip -vlnv xilinx.com:ip:util_vector_logic:2.0 util_vector_logic_13
set_property -dict {CONFIG.C_SIZE 1 CONFIG.C_OPERATION not} [get_bd_cells util_vector_logic_13]
create_bd_cell -type ip -vlnv xilinx.com:ip:util_vector_logic:2.0 util_vector_logic_14
set_property -dict {CONFIG.C_SIZE 1 CONFIG.C_OPERATION not} [get_bd_cells util_vector_logic_14]
create_bd_cell -type ip -vlnv xilinx.com:ip:util_vector_logic:2.0 util_vector_logic_15
set_property -dict {CONFIG.C_SIZE 1 CONFIG.C_OPERATION not} [get_bd_cells util_vector_logic_15]
create_bd_cell -type ip -vlnv xilinx.com:ip:util_vector_logic:2.0 util_vector_logic_16
set_property -dict {CONFIG.C_SIZE 1 CONFIG.C_OPERATION not} [get_bd_cells util_vector_logic_16]
create_bd_cell -type ip -vlnv xilinx.com:ip:util_vector_logic:2.0 util_vector_logic_17
set_property -dict {CONFIG.C_SIZE 1 CONFIG.C_OPERATION not} [get_bd_cells util_vector_logic_17]
create_bd_cell -type ip -vlnv xilinx.com:ip:util_vector_logic:2.0 util_vector_logic_18
set_property -dict {CONFIG.C_SIZE 1 CONFIG.C_OPERATION not} [get_bd_cells util_vector_logic_18]
create_bd_cell -type ip -vlnv xilinx.com:ip:util_vector_logic:2.0 util_vector_logic_19
set_property -dict {CONFIG.C_SIZE 1 CONFIG.C_OPERATION not} [get_bd_cells util_vector_logic_19]
create_bd_cell -type ip -vlnv xilinx.com:ip:util_vector_logic:2.0 util_vector_logic_20
set_property -dict {CONFIG.C_SIZE 1 CONFIG.C_OPERATION not} [get_bd_cells util_vector_logic_20]
create_bd_cell -type ip -vlnv xilinx.com:ip:util_vector_logic:2.0 util_vector_logic_21
set_property -dict {CONFIG.C_SIZE 1 CONFIG.C_OPERATION not} [get_bd_cells util_vector_logic_21]
create_bd_cell -type ip -vlnv xilinx.com:ip:util_vector_logic:2.0 util_vector_logic_22
set_property -dict {CONFIG.C_SIZE 1 CONFIG.C_OPERATION not} [get_bd_cells util_vector_logic_22]
create_bd_cell -type ip -vlnv xilinx.com:ip:util_vector_logic:2.0 util_vector_logic_23
set_property -dict {CONFIG.C_SIZE 1 CONFIG.C_OPERATION not} [get_bd_cells util_vector_logic_23]
create_bd_cell -type ip -vlnv xilinx.com:ip:util_vector_logic:2.0 util_vector_logic_24
set_property -dict {CONFIG.C_SIZE 1 CONFIG.C_OPERATION not} [get_bd_cells util_vector_logic_24]
create_bd_cell -type ip -vlnv xilinx.com:ip:util_vector_logic:2.0 util_vector_logic_25
set_property -dict {CONFIG.C_SIZE 1 CONFIG.C_OPERATION not} [get_bd_cells util_vector_logic_25]
create_bd_cell -type ip -vlnv xilinx.com:ip:util_vector_logic:2.0 util_vector_logic_26
set_property -dict {CONFIG.C_SIZE 1 CONFIG.C_OPERATION not} [get_bd_cells util_vector_logic_26]
create_bd_cell -type ip -vlnv xilinx.com:ip:util_vector_logic:2.0 util_vector_logic_27
set_property -dict {CONFIG.C_SIZE 1 CONFIG.C_OPERATION not} [get_bd_cells util_vector_logic_27]
create_bd_cell -type ip -vlnv xilinx.com:ip:util_vector_logic:2.0 util_vector_logic_28
set_property -dict {CONFIG.C_SIZE 1 CONFIG.C_OPERATION not} [get_bd_cells util_vector_logic_28]
create_bd_cell -type ip -vlnv xilinx.com:ip:util_vector_logic:2.0 util_vector_logic_29
set_property -dict {CONFIG.C_SIZE 1 CONFIG.C_OPERATION not} [get_bd_cells util_vector_logic_29]
create_bd_cell -type ip -vlnv xilinx.com:ip:util_vector_logic:2.0 util_vector_logic_30
set_property -dict {CONFIG.C_SIZE 1 CONFIG.C_OPERATION not} [get_bd_cells util_vector_logic_30]
create_bd_cell -type ip -vlnv xilinx.com:ip:util_vector_logic:2.0 util_vector_logic_31
set_property -dict {CONFIG.C_SIZE 1 CONFIG.C_OPERATION not} [get_bd_cells util_vector_logic_31]

# ---- connections ----

current_bd_instance /Axi_GPIOs
connect_bd_intf_net [get_bd_intf_pins S_AXI] [get_bd_intf_pins axi_gpio_LED/S_AXI]
connect_bd_intf_net [get_bd_intf_pins GPIO] [get_bd_intf_pins axi_gpio_LED/GPIO]
connect_bd_intf_net [get_bd_intf_pins S_AXI2] [get_bd_intf_pins axi_gpio_SW/S_AXI]
connect_bd_intf_net [get_bd_intf_pins GPIO2] [get_bd_intf_pins axi_gpio_SW/GPIO]
connect_bd_net -net processing_system7_0_FCLK_CLK0 [get_bd_pins s_axi_aclk] [get_bd_pins axi_gpio_SW/s_axi_aclk] [get_bd_pins axi_gpio_LED/s_axi_aclk]
connect_bd_net -net rst_ps7_0_100M_peripheral_aresetn [get_bd_pins s_axi_aresetn] \
  [get_bd_pins axi_gpio_SW/s_axi_aresetn] [get_bd_pins axi_gpio_LED/s_axi_aresetn]

current_bd_instance /Uart_Blocks
connect_bd_intf_net [get_bd_intf_pins AllDataMover_0/m_axi_DRAM] [get_bd_intf_pins smartconnect_0/S00_AXI]
connect_bd_intf_net [get_bd_intf_pins All_Data_Sender_0/m_axi_DRAM] [get_bd_intf_pins smartconnect_0/S01_AXI]
connect_bd_intf_net [get_bd_intf_pins M00_AXI1] [get_bd_intf_pins smartconnect_0/M00_AXI]
connect_bd_intf_net [get_bd_intf_pins s_axi_AXILiteS16] [get_bd_intf_pins All_Data_Sender_0/s_axi_AXILiteS]
connect_bd_net -net processing_system7_0_FCLK_CLK0 [get_bd_pins s_axi_aclk] \
  [get_bd_pins smartconnect_0/aclk] [get_bd_pins All_Data_Sender_0/ap_clk] [get_bd_pins AllDataMover_0/ap_clk] \
  [get_bd_pins Uart_2/s_axi_aclk] [get_bd_pins Uart_4/s_axi_aclk] [get_bd_pins Uart_5/s_axi_aclk] \
  [get_bd_pins Uart_6/s_axi_aclk] [get_bd_pins Uart_7/s_axi_aclk] [get_bd_pins Uart_8/s_axi_aclk] \
  [get_bd_pins Uart_9/s_axi_aclk] [get_bd_pins Uart_10/s_axi_aclk] [get_bd_pins Uart_12/s_axi_aclk] \
  [get_bd_pins Uart_14/s_axi_aclk] [get_bd_pins Uart_15/s_axi_aclk] [get_bd_pins Uart_13/s_axi_aclk] \
  [get_bd_pins Uart_0/s_axi_aclk] [get_bd_pins Uart_1/i_CLK] [get_bd_pins Buadrate_Generator/i_CLK1] \
  [get_bd_pins Uart_config/s_axi_aclk] [get_bd_pins Uart_3/s_axi_aclk] [get_bd_pins Uart_11/s_axi_aclk] \
  [get_bd_pins Uart_Master_Slave/s_axi_aclk]
connect_bd_net -net rst_ps7_0_100M_peripheral_aresetn [get_bd_pins s_axi_aresetn] \
  [get_bd_pins smartconnect_0/aresetn] [get_bd_pins All_Data_Sender_0/ap_rst_n] [get_bd_pins AllDataMover_0/ap_rst_n]
connect_bd_net -net rst_ps7_0_100M_peripheral_reset [get_bd_pins i_Reset_Periph] \
  [get_bd_pins Uart_2/i_Reset] [get_bd_pins Uart_4/i_Reset] [get_bd_pins Uart_5/i_Reset] [get_bd_pins Uart_6/i_Reset] \
  [get_bd_pins Uart_7/i_Reset] [get_bd_pins Uart_8/i_Reset] [get_bd_pins Uart_9/i_Reset] [get_bd_pins Uart_10/i_Reset] \
  [get_bd_pins Uart_12/i_Reset] [get_bd_pins Uart_13/i_Reset] [get_bd_pins Uart_14/i_Reset] [get_bd_pins Uart_15/i_Reset] \
  [get_bd_pins Uart_0/i_Reset] [get_bd_pins Uart_1/i_Reset] [get_bd_pins Uart_config/i_Reset] [get_bd_pins Uart_3/i_Reset] \
  [get_bd_pins Uart_11/i_Reset] [get_bd_pins Uart_Master_Slave/i_Reset]
connect_bd_net -net i_UART_RX2_1 [get_bd_pins i_RXD13] [get_bd_pins Uart_1/i_RXD]
connect_bd_net -net i_RXD14_1 [get_bd_pins i_RXD14] [get_bd_pins Uart_2/i_RXD]
connect_bd_net -net i_RXD1_1 [get_bd_pins i_RXD1] [get_bd_pins Uart_4/i_RXD]
connect_bd_net -net i_RXD2_1 [get_bd_pins i_RXD2] [get_bd_pins Uart_5/i_RXD]
connect_bd_net -net i_RXD4_1 [get_bd_pins i_RXD4] [get_bd_pins Uart_6/i_RXD]
connect_bd_net -net i_RXD5_1 [get_bd_pins i_RXD5] [get_bd_pins Uart_7/i_RXD]
connect_bd_net -net i_RXD8_1 [get_bd_pins i_RXD8] [get_bd_pins Uart_8/i_RXD]
connect_bd_net -net i_RXD9_1 [get_bd_pins i_RXD9] [get_bd_pins Uart_9/i_RXD]
connect_bd_net -net i_RXD3_1 [get_bd_pins i_RXD3] [get_bd_pins Uart_10/i_RXD]
connect_bd_net -net i_RXD7_1 [get_bd_pins i_RXD7] [get_bd_pins Uart_12/i_RXD]
connect_bd_net -net i_RXD10_1 [get_bd_pins i_RXD10] [get_bd_pins Uart_13/i_RXD]
connect_bd_net -net i_RXD11_1 [get_bd_pins i_RXD11] [get_bd_pins Uart_14/i_RXD]
connect_bd_net -net i_RXD12_1 [get_bd_pins i_RXD12] [get_bd_pins Uart_15/i_RXD]
connect_bd_net [get_bd_pins i_RXD15] [get_bd_pins Uart_0/i_RXD]
connect_bd_net [get_bd_pins Uart_0/dout_0] [get_bd_pins AllDataMover_0/uart1_V_dout]
connect_bd_net [get_bd_pins Uart_0/empty_0] [get_bd_pins AllDataMover_0/uart1_V_empty_n]
connect_bd_net -net rd_en_0_1 [get_bd_pins AllDataMover_0/uart1_V_read] [get_bd_pins Uart_0/rd_en_0]
connect_bd_net [get_bd_pins Uart_1/dout_1] [get_bd_pins AllDataMover_0/uart2_V_dout]
connect_bd_net [get_bd_pins Uart_1/empty_1] [get_bd_pins AllDataMover_0/uart2_V_empty_n]
connect_bd_net [get_bd_pins AllDataMover_0/uart2_V_read] [get_bd_pins Uart_1/rd_en_1]
connect_bd_net [get_bd_pins Uart_2/dout_2] [get_bd_pins AllDataMover_0/uart3_V_dout]
connect_bd_net [get_bd_pins Uart_2/empty_2] [get_bd_pins AllDataMover_0/uart3_V_empty_n]
connect_bd_net [get_bd_pins AllDataMover_0/uart3_V_read] [get_bd_pins Uart_2/rd_en_2]
connect_bd_net [get_bd_pins Uart_4/dout_4] [get_bd_pins AllDataMover_0/uart5_V_dout]
connect_bd_net [get_bd_pins Uart_4/empty_4] [get_bd_pins AllDataMover_0/uart5_V_empty_n]
connect_bd_net [get_bd_pins AllDataMover_0/uart5_V_read] [get_bd_pins Uart_4/rd_en_4]
connect_bd_net [get_bd_pins Uart_5/dout_5] [get_bd_pins AllDataMover_0/uart6_V_dout]
connect_bd_net [get_bd_pins Uart_5/empty_5] [get_bd_pins AllDataMover_0/uart6_V_empty_n]
connect_bd_net [get_bd_pins AllDataMover_0/uart6_V_read] [get_bd_pins Uart_5/rd_en_5]
connect_bd_net [get_bd_pins Uart_6/dout_6] [get_bd_pins AllDataMover_0/uart7_V_dout]
connect_bd_net [get_bd_pins Uart_6/empty_6] [get_bd_pins AllDataMover_0/uart7_V_empty_n]
connect_bd_net [get_bd_pins AllDataMover_0/uart7_V_read] [get_bd_pins Uart_6/rd_en_6]
connect_bd_net [get_bd_pins Uart_7/dout_7] [get_bd_pins AllDataMover_0/uart8_V_dout]
connect_bd_net [get_bd_pins Uart_7/empty_7] [get_bd_pins AllDataMover_0/uart8_V_empty_n]
connect_bd_net [get_bd_pins AllDataMover_0/uart8_V_read] [get_bd_pins Uart_7/rd_en_7]
connect_bd_net [get_bd_pins Uart_8/dout_8] [get_bd_pins AllDataMover_0/uart9_V_dout]
connect_bd_net [get_bd_pins Uart_8/empty_8] [get_bd_pins AllDataMover_0/uart9_V_empty_n]
connect_bd_net [get_bd_pins AllDataMover_0/uart9_V_read] [get_bd_pins Uart_8/rd_en_8]
connect_bd_net [get_bd_pins Uart_9/dout_9] [get_bd_pins AllDataMover_0/uart10_V_dout]
connect_bd_net [get_bd_pins Uart_9/empty_9] [get_bd_pins AllDataMover_0/uart10_V_empty_n]
connect_bd_net -net rd_en_8_1 [get_bd_pins AllDataMover_0/uart10_V_read] [get_bd_pins Uart_9/rd_en_8]
connect_bd_net [get_bd_pins Uart_10/dout_10] [get_bd_pins AllDataMover_0/uart11_V_dout]
connect_bd_net [get_bd_pins Uart_10/empty_10] [get_bd_pins AllDataMover_0/uart11_V_empty_n]
connect_bd_net -net rd_en_10_1 [get_bd_pins AllDataMover_0/uart11_V_read] [get_bd_pins Uart_10/rd_en_10]
connect_bd_net [get_bd_pins Uart_12/dout_12] [get_bd_pins AllDataMover_0/uart13_V_dout]
connect_bd_net [get_bd_pins Uart_12/empty_12] [get_bd_pins AllDataMover_0/uart13_V_empty_n]
connect_bd_net [get_bd_pins AllDataMover_0/uart13_V_read] [get_bd_pins Uart_12/rd_en_12]
connect_bd_net [get_bd_pins Uart_13/dout_13] [get_bd_pins AllDataMover_0/uart14_V_dout]
connect_bd_net [get_bd_pins Uart_13/empty_13] [get_bd_pins AllDataMover_0/uart14_V_empty_n]
connect_bd_net [get_bd_pins AllDataMover_0/uart14_V_read] [get_bd_pins Uart_13/rd_en_13]
connect_bd_net [get_bd_pins Uart_14/dout_14] [get_bd_pins AllDataMover_0/uart15_V_dout]
connect_bd_net [get_bd_pins Uart_14/empty_14] [get_bd_pins AllDataMover_0/uart15_V_empty_n]
connect_bd_net [get_bd_pins AllDataMover_0/uart15_V_read] [get_bd_pins Uart_14/rd_en_14]
connect_bd_net [get_bd_pins Uart_15/dout_15] [get_bd_pins AllDataMover_0/uart16_V_dout]
connect_bd_net [get_bd_pins Uart_15/empty_15] [get_bd_pins AllDataMover_0/uart16_V_empty_n]
connect_bd_net -net rd_en_15_1 [get_bd_pins AllDataMover_0/uart16_V_read] [get_bd_pins Uart_15/rd_en_15]
connect_bd_net -net util_vector_logic_0_Res [get_bd_pins Uart_0/n_Busy] [get_bd_pins All_Data_Sender_0/uart1_V_full_n]
connect_bd_net -net util_vector_logic_1_Res [get_bd_pins Uart_1/n_Busy] [get_bd_pins All_Data_Sender_0/uart2_V_full_n]
connect_bd_net -net UART_TX_0_o_TXD [get_bd_pins Uart_0/o_TXD] [get_bd_pins o_TXD]
connect_bd_net -net UART_TX_1_o_TXD [get_bd_pins Uart_1/o_TXD] [get_bd_pins o_TXD1]
connect_bd_net [get_bd_pins All_Data_Sender_0/uart1_V_din] [get_bd_pins Uart_0/i_Data]
connect_bd_net [get_bd_pins All_Data_Sender_0/uart2_V_din] [get_bd_pins Uart_1/i_Data]
connect_bd_net [get_bd_pins All_Data_Sender_0/uart1_V_write] [get_bd_pins Uart_0/i_Send]
connect_bd_net [get_bd_pins All_Data_Sender_0/uart2_V_write] [get_bd_pins Uart_1/i_Send]
connect_bd_net [get_bd_pins Uart_2/n_Busy] [get_bd_pins All_Data_Sender_0/uart3_V_full_n]
connect_bd_net [get_bd_pins All_Data_Sender_0/uart5_V_din] [get_bd_pins Uart_4/i_Data]
connect_bd_net [get_bd_pins All_Data_Sender_0/uart5_V_write] [get_bd_pins Uart_4/i_Send]
connect_bd_net [get_bd_pins Uart_4/n_Busy] [get_bd_pins All_Data_Sender_0/uart5_V_full_n]
connect_bd_net [get_bd_pins All_Data_Sender_0/uart6_V_din] [get_bd_pins Uart_5/i_Data]
connect_bd_net [get_bd_pins All_Data_Sender_0/uart6_V_write] [get_bd_pins Uart_5/i_Send]
connect_bd_net [get_bd_pins Uart_5/n_Busy] [get_bd_pins All_Data_Sender_0/uart6_V_full_n]
connect_bd_net [get_bd_pins All_Data_Sender_0/uart7_V_din] [get_bd_pins Uart_6/i_Data]
connect_bd_net [get_bd_pins All_Data_Sender_0/uart7_V_write] [get_bd_pins Uart_6/i_Send]
connect_bd_net [get_bd_pins Uart_6/n_Busy] [get_bd_pins All_Data_Sender_0/uart7_V_full_n]
connect_bd_net [get_bd_pins All_Data_Sender_0/uart8_V_din] [get_bd_pins Uart_7/i_Data]
connect_bd_net [get_bd_pins All_Data_Sender_0/uart8_V_write] [get_bd_pins Uart_7/i_Send]
connect_bd_net [get_bd_pins Uart_7/n_Busy] [get_bd_pins All_Data_Sender_0/uart8_V_full_n]
connect_bd_net [get_bd_pins All_Data_Sender_0/uart9_V_din] [get_bd_pins Uart_8/i_Data]
connect_bd_net [get_bd_pins All_Data_Sender_0/uart9_V_write] [get_bd_pins Uart_8/i_Send]
connect_bd_net [get_bd_pins All_Data_Sender_0/uart10_V_din] [get_bd_pins Uart_9/i_Data]
connect_bd_net [get_bd_pins All_Data_Sender_0/uart10_V_write] [get_bd_pins Uart_9/i_Send]
connect_bd_net [get_bd_pins All_Data_Sender_0/uart11_V_din] [get_bd_pins Uart_10/i_Data]
connect_bd_net [get_bd_pins All_Data_Sender_0/uart11_V_write] [get_bd_pins Uart_10/i_Send]
connect_bd_net [get_bd_pins All_Data_Sender_0/uart13_V_din] [get_bd_pins Uart_12/i_Data]
connect_bd_net [get_bd_pins All_Data_Sender_0/uart13_V_write] [get_bd_pins Uart_12/i_Send]
connect_bd_net [get_bd_pins All_Data_Sender_0/uart14_V_din] [get_bd_pins Uart_13/i_Data]
connect_bd_net [get_bd_pins All_Data_Sender_0/uart14_V_write] [get_bd_pins Uart_13/i_Send]
connect_bd_net [get_bd_pins All_Data_Sender_0/uart15_V_din] [get_bd_pins Uart_14/i_Data]
connect_bd_net [get_bd_pins All_Data_Sender_0/uart15_V_write] [get_bd_pins Uart_14/i_Send]
connect_bd_net [get_bd_pins All_Data_Sender_0/uart16_V_din] [get_bd_pins Uart_15/i_Data]
connect_bd_net [get_bd_pins All_Data_Sender_0/uart16_V_write] [get_bd_pins Uart_15/i_Send]
connect_bd_net [get_bd_pins Uart_8/n_Busy] [get_bd_pins All_Data_Sender_0/uart9_V_full_n]
connect_bd_net [get_bd_pins Uart_9/n_Busy] [get_bd_pins All_Data_Sender_0/uart10_V_full_n]
connect_bd_net [get_bd_pins Uart_10/n_Busy] [get_bd_pins All_Data_Sender_0/uart11_V_full_n]
connect_bd_net [get_bd_pins Uart_12/n_Busy] [get_bd_pins All_Data_Sender_0/uart13_V_full_n]
connect_bd_net [get_bd_pins Uart_13/n_Busy] [get_bd_pins All_Data_Sender_0/uart14_V_full_n]
connect_bd_net [get_bd_pins Uart_14/n_Busy] [get_bd_pins All_Data_Sender_0/uart15_V_full_n]
connect_bd_net [get_bd_pins Uart_15/n_Busy] [get_bd_pins All_Data_Sender_0/uart16_V_full_n]
connect_bd_net [get_bd_pins Uart_2/o_TXD] [get_bd_pins o_TXD2]
connect_bd_net [get_bd_pins Uart_4/o_TXD] [get_bd_pins o_TXD4]
connect_bd_net [get_bd_pins Uart_5/o_TXD] [get_bd_pins o_TXD5]
connect_bd_net [get_bd_pins Uart_6/o_TXD] [get_bd_pins o_TXD6]
connect_bd_net [get_bd_pins Uart_7/o_TXD] [get_bd_pins o_TXD7]
connect_bd_net [get_bd_pins Uart_8/o_TXD] [get_bd_pins o_TXD8]
connect_bd_net [get_bd_pins Uart_9/o_TXD] [get_bd_pins o_TXD9]
connect_bd_net [get_bd_pins Uart_10/o_TXD] [get_bd_pins o_TXD10]
connect_bd_net [get_bd_pins Uart_12/o_TXD] [get_bd_pins o_TXD12]
connect_bd_net [get_bd_pins Uart_13/o_TXD] [get_bd_pins o_TXD13]
connect_bd_net [get_bd_pins Uart_14/o_TXD] [get_bd_pins o_TXD14]
connect_bd_net [get_bd_pins Uart_15/o_TXD] [get_bd_pins o_TXD15]
connect_bd_net [get_bd_pins i_Reset] [get_bd_pins Buadrate_Generator/i_Reset]
connect_bd_net [get_bd_pins i_CLK] [get_bd_pins Buadrate_Generator/i_CLK]
connect_bd_net -net i_Send_1 [get_bd_pins All_Data_Sender_0/uart3_V_write] [get_bd_pins Uart_2/i_Send]
connect_bd_net -net i_Data_1 [get_bd_pins All_Data_Sender_0/uart3_V_din] [get_bd_pins Uart_2/i_Data]
connect_bd_net -net Buadrate_Generator_o_OutRx_0 [get_bd_pins Buadrate_Generator/o_Out_0] [get_bd_pins Uart_0/i_Baud16x]
connect_bd_net -net Buadrate_Generator_o_OutRx_1 [get_bd_pins Buadrate_Generator/o_Out_1] [get_bd_pins Uart_1/i_Baud16x]
connect_bd_net -net Buadrate_Generator_o_OutRx_2 [get_bd_pins Buadrate_Generator/o_Out_2] [get_bd_pins Uart_2/i_Baud16x]
connect_bd_net -net Buadrate_Generator_o_OutRx_4 [get_bd_pins Buadrate_Generator/o_Out_4] [get_bd_pins Uart_4/i_Baud16x]
connect_bd_net -net Buadrate_Generator_o_OutRx_5 [get_bd_pins Buadrate_Generator/o_Out_5] [get_bd_pins Uart_5/i_Baud16x]
connect_bd_net -net Buadrate_Generator_o_OutRx_6 [get_bd_pins Buadrate_Generator/o_Out_6] [get_bd_pins Uart_6/i_Baud16x]
connect_bd_net -net Buadrate_Generator_o_OutRx_7 [get_bd_pins Buadrate_Generator/o_Out_7] [get_bd_pins Uart_7/i_Baud16x]
connect_bd_net -net Buadrate_Generator_o_OutRx_8 [get_bd_pins Buadrate_Generator/o_Out_8] [get_bd_pins Uart_8/i_Baud16x]
connect_bd_net -net Buadrate_Generator_o_OutRx_9 [get_bd_pins Buadrate_Generator/o_Out_9] [get_bd_pins Uart_9/i_Baud16x]
connect_bd_net -net Buadrate_Generator_o_OutRx_10 [get_bd_pins Buadrate_Generator/o_Out_10] [get_bd_pins Uart_10/i_Baud16x]
connect_bd_net -net Buadrate_Generator_o_OutRx_12 [get_bd_pins Buadrate_Generator/o_Out_12] [get_bd_pins Uart_12/i_Baud16x]
connect_bd_net -net Buadrate_Generator_o_OutRx_13 [get_bd_pins Buadrate_Generator/o_Out_13] [get_bd_pins Uart_13/i_Baud16x]
connect_bd_net -net Buadrate_Generator_o_OutRx_14 [get_bd_pins Buadrate_Generator/o_Out_14] [get_bd_pins Uart_14/i_Baud16x]
connect_bd_net -net Buadrate_Generator_o_OutRx_15 [get_bd_pins Buadrate_Generator/o_Out_15] [get_bd_pins Uart_15/i_Baud16x]
connect_bd_net [get_bd_pins AllDataMover_0/uart17_V_read] [get_bd_pins Uart_config/rd_en_14]
connect_bd_net [get_bd_pins All_Data_Sender_0/uart17_V_din] [get_bd_pins Uart_config/i_Data]
connect_bd_net -net i_Send_2 [get_bd_pins All_Data_Sender_0/uart17_V_write] [get_bd_pins Uart_config/i_Send]
connect_bd_net [get_bd_pins Uart_config/dout_14] [get_bd_pins AllDataMover_0/uart17_V_dout]
connect_bd_net [get_bd_pins Uart_config/empty_14] [get_bd_pins AllDataMover_0/uart17_V_empty_n]
connect_bd_net [get_bd_pins Uart_config/n_Busy] [get_bd_pins All_Data_Sender_0/uart17_V_full_n]
connect_bd_net -net i_Baud_2 [get_bd_pins Buadrate_Generator/o_Baud_115200] [get_bd_pins Uart_config/i_Baud] [get_bd_pins Uart_Master_Slave/i_Baud]
connect_bd_net -net i_Baud16x_1 [get_bd_pins Buadrate_Generator/o_Baud_115200_16x] \
  [get_bd_pins Uart_config/i_Baud16x] [get_bd_pins Uart_Master_Slave/i_Baud16x]
connect_bd_net [get_bd_pins Uart_config/o_TXD] [get_bd_pins o_TXD_Config]
connect_bd_net -net i_RXD_3 [get_bd_pins i_RXD_Config] [get_bd_pins Uart_config/i_RXD]
connect_bd_net -net busy_V1_1 [get_bd_pins busy_V1] [get_bd_pins AllDataMover_0/busy_V]
connect_bd_net [get_bd_pins i_input] [get_bd_pins Buadrate_Generator/i_input]
connect_bd_net [get_bd_pins Uart_3/dout_3] [get_bd_pins AllDataMover_0/uart4_V_dout]
connect_bd_net [get_bd_pins Uart_3/n_Busy] [get_bd_pins All_Data_Sender_0/uart4_V_full_n]
connect_bd_net [get_bd_pins All_Data_Sender_0/uart4_V_din] [get_bd_pins Uart_3/i_Data]
connect_bd_net [get_bd_pins Uart_3/empty_3] [get_bd_pins AllDataMover_0/uart4_V_empty_n]
connect_bd_net [get_bd_pins i_RXD] [get_bd_pins Uart_3/i_RXD]
connect_bd_net [get_bd_pins All_Data_Sender_0/uart4_V_write] [get_bd_pins Uart_3/i_Send]
connect_bd_net [get_bd_pins AllDataMover_0/uart4_V_read] [get_bd_pins Uart_3/rd_en_3]
connect_bd_net -net Buadrate_Generator_o_OutRx_3 [get_bd_pins Buadrate_Generator/o_Out_3] [get_bd_pins Uart_3/i_Baud16x]
connect_bd_net [get_bd_pins Uart_3/o_TXD] [get_bd_pins o_TXD3]
connect_bd_net -net i_RXD6_1 [get_bd_pins i_RXD6] [get_bd_pins Uart_11/i_RXD]
connect_bd_net [get_bd_pins Uart_11/empty_11] [get_bd_pins AllDataMover_0/uart12_V_empty_n]
connect_bd_net [get_bd_pins AllDataMover_0/uart12_V_read] [get_bd_pins Uart_11/rd_en_11]
connect_bd_net [get_bd_pins Uart_11/dout_11] [get_bd_pins AllDataMover_0/uart12_V_dout]
connect_bd_net -net Buadrate_Generator_o_OutRx_11 [get_bd_pins Buadrate_Generator/o_Out_11] [get_bd_pins Uart_11/i_Baud16x]
connect_bd_net [get_bd_pins Uart_11/n_Busy] [get_bd_pins All_Data_Sender_0/uart12_V_full_n]
connect_bd_net [get_bd_pins All_Data_Sender_0/uart12_V_din] [get_bd_pins Uart_11/i_Data]
connect_bd_net [get_bd_pins Uart_11/o_TXD] [get_bd_pins o_TXD11]
connect_bd_net [get_bd_pins All_Data_Sender_0/uart12_V_write] [get_bd_pins Uart_11/i_Send]
connect_bd_net [get_bd_pins Buadrate_Generator/o_Parity_0] [get_bd_pins Uart_0/i_Parity]
connect_bd_net [get_bd_pins Buadrate_Generator/o_StopBit_0] [get_bd_pins Uart_0/i_Stop_Bit]
connect_bd_net [get_bd_pins Buadrate_Generator/o_Parity_1] [get_bd_pins Uart_1/i_Parity]
connect_bd_net [get_bd_pins Buadrate_Generator/o_StopBit_1] [get_bd_pins Uart_1/i_Stop_Bit]
connect_bd_net [get_bd_pins Buadrate_Generator/o_Parity_2] [get_bd_pins Uart_2/i_Parity]
connect_bd_net [get_bd_pins Buadrate_Generator/o_StopBit_2] [get_bd_pins Uart_2/i_Stop_Bit]
connect_bd_net [get_bd_pins Buadrate_Generator/o_Parity_3] [get_bd_pins Uart_3/i_Parity]
connect_bd_net [get_bd_pins Buadrate_Generator/o_StopBit_3] [get_bd_pins Uart_3/i_Stop_Bit]
connect_bd_net [get_bd_pins Buadrate_Generator/o_Parity_4] [get_bd_pins Uart_4/i_Parity]
connect_bd_net [get_bd_pins Buadrate_Generator/o_StopBit_4] [get_bd_pins Uart_4/i_Stop_Bit]
connect_bd_net [get_bd_pins Buadrate_Generator/o_Parity_5] [get_bd_pins Uart_5/i_Parity]
